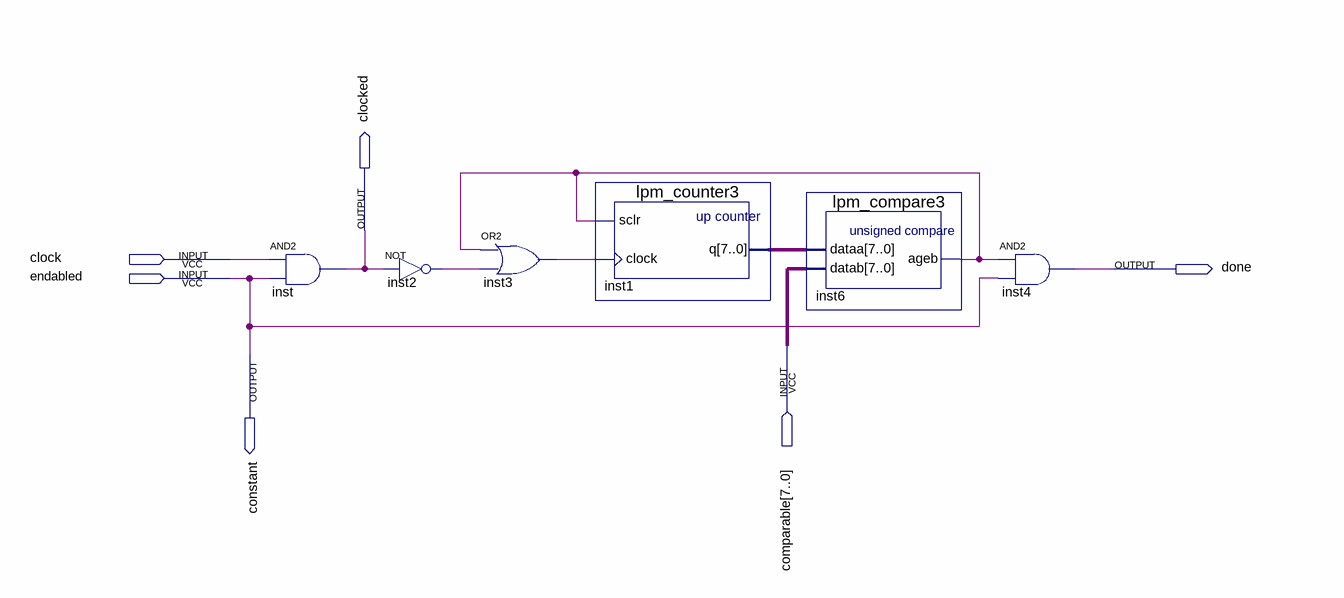
[diagram p0: schematic sheet]
// Quartus schematic super_counter.bdf as structural Verilog: 6 symbols, 6 pins
module super_counter (
  input  clock,
  input  endabled,
  input  [7:0] comparable,
  output clocked,
  output done,
  output constant
);

  wire inst2_out, inst3_out, inst6_ageb;
  wire [7:0] inst1_q;

  and inst (clocked, clock, endabled);
  not inst2 (inst2_out, clocked);
  or inst3 (inst3_out, inst6_ageb, inst2_out);
  lpm_counter3 inst1 (.sclr(inst6_ageb), .clock(inst3_out), .q(inst1_q));
  lpm_compare3 inst6 (.dataa(inst1_q), .datab(comparable), .ageb(inst6_ageb));
  and inst4 (done, inst6_ageb, endabled);

  assign constant = endabled;
endmodule
